# EAGLE design pcb_Becker (EAGLE 8.0.0)
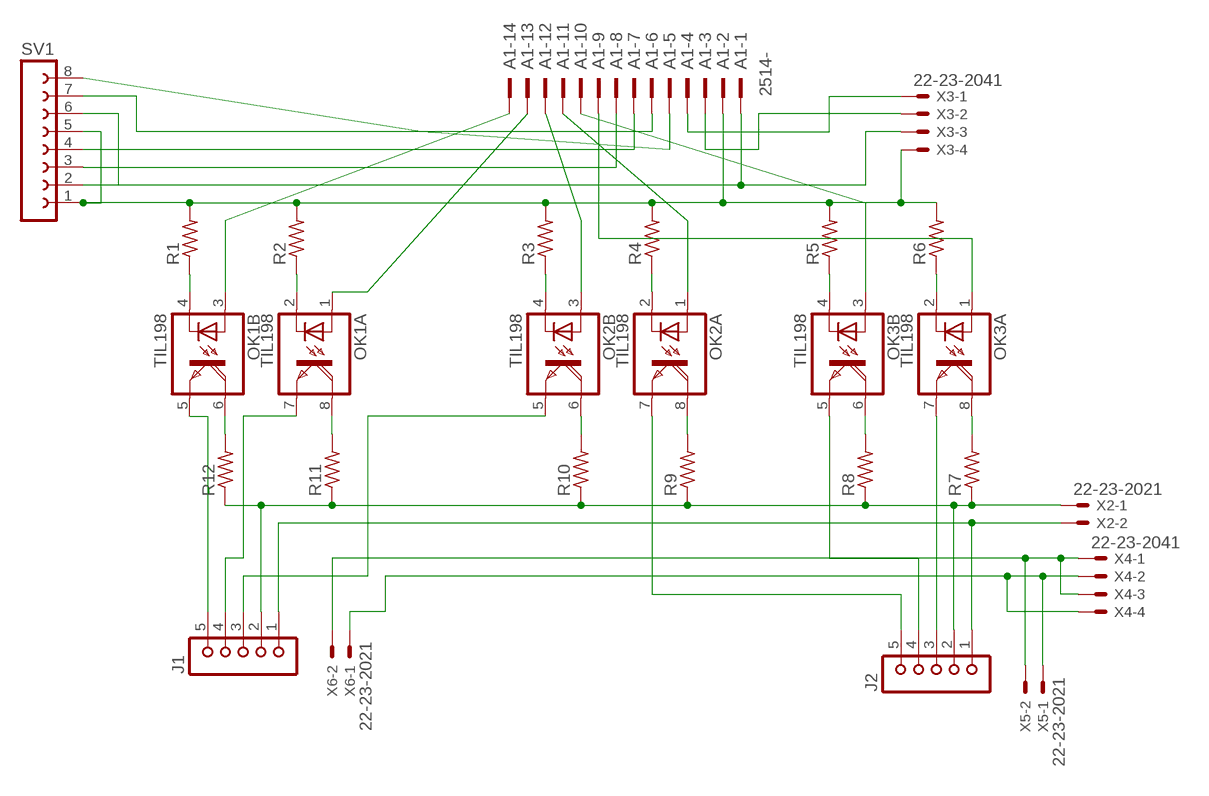
[diagram p0: schematic, sheet 1]

## Parts
A1  2514-  [PAK100/2500-14]
J1  JU05  [JU05]
J2  JU05  [JU05]
OK1  TIL198  [DIL08]
OK2  TIL198  [DIL08]
OK3  TIL198  [DIL08]
R1  R-US_0207/10  [0207/10]
R2  R-US_0207/10  [0207/10]
R3  R-US_0207/10  [0207/10]
R4  R-US_0207/10  [0207/10]
R5  R-US_0207/10  [0207/10]
R6  R-US_0207/10  [0207/10]
R7  R-US_0207/10  [0207/10]
R8  R-US_0207/10  [0207/10]
R9  R-US_0207/10  [0207/10]
R10  R-US_0207/10  [0207/10]
R11  R-US_0207/10  [0207/10]
R12  R-US_0207/10  [0207/10]
SV1  FE08-1  [FE08]
X2  22-23-2021  [22-23-2021]
X3  22-23-2041  [22-23-2041]
X4  22-23-2041  [22-23-2041]
X5  22-23-2021  [22-23-2021]
X6  22-23-2021  [22-23-2021]

## Nets
N$1: OK1.4(B:C) R1.1
N$2: OK1.2(A:C) R2.1
N$3: OK2.4(B:C) R3.1
N$4: OK2.2(A:C) R4.1
N$5: OK3.4(B:C) R5.1
N$6: OK3.2(A:C) R6.1
N$7: OK3.8(A:COL) R7.2
N$8: OK3.6(B:COL) R8.2
N$9: OK2.8(A:COL) R9.2
N$10: OK2.6(B:COL) R10.2
N$11: OK1.8(A:COL) R11.2
N$12: OK1.6(B:COL) R12.2
N$13: A1.14 OK1.3(B:A)
N$14: A1.13 OK1.1(A:A)
N$15: A1.12 OK2.3(B:A)
N$16: A1.11 OK2.1(A:A)
N$17: A1.10 OK3.3(B:A)
N$18: A1.9 OK3.1(A:A)
N$19: A1.2 R1.2 R2.2 R3.2 R4.2 R5.2 R6.2 SV1.1 SV1.5 X3.4
N$20: J1.5 OK1.5(B:EMI)
N$21: J1.4 OK1.7(A:EMI)
N$22: J1.3 OK2.5(B:EMI)
N$23: J2.5 OK2.7(A:EMI)
N$24: J2.4 OK3.5(B:EMI)
N$25: J2.3 OK3.7(A:EMI)
N$26: J1.2 J2.2 R7.1 R8.1 R9.1 R10.1 R11.1 R12.1 X2.1
N$27: J1.1 J2.1 X2.2
N$28: A1.1 SV1.2 SV1.6 X3.3
N$29: A1.8 SV1.3
N$30: A1.7 SV1.4
N$31: A1.6 SV1.7
N$32: A1.5 SV1.8
N$33: A1.4 X3.1
N$34: A1.3 X3.2
N$35: X4.1 X4.3 X5.2 X6.2
N$36: X4.2 X4.4 X5.1 X6.1

## Library data of the parts
A1 = con-3m:2514-: 3M (TM) Pak 100 4-Wall Header Source: 3M; OC_FARNELL: unknown; OC_NEWARK: unknown
J1 J2 = con-lsta:JU05: PIN HEADER; OC_FARNELL: unknown; OC_NEWARK: unknown
OK1-OK3 = optocoupler-2:TIL198: TEXAS INSTRUMENTS OPTO COUPLER
R1-R12 = resistor:R-US_: RESISTOR, American symbol
SV1 = con-lsta:FE08-1: FEMALE HEADER; OC_FARNELL: unknown; OC_NEWARK: unknown
X2 X5 X6 = con-molex:22-23-2021: .100" (2.54mm) Center Header - 2 Pin; MF: MOLEX; MPN: 22-23-2021; OC_FARNELL: 1462926; OC_NEWARK: 25C3832
X3 X4 = con-molex:22-23-2041: .100" (2.54mm) Center Header - 4 Pin; MF: MOLEX; MPN: 22-23-2041; OC_FARNELL: 1462920; OC_NEWARK: 38C0355

## Board
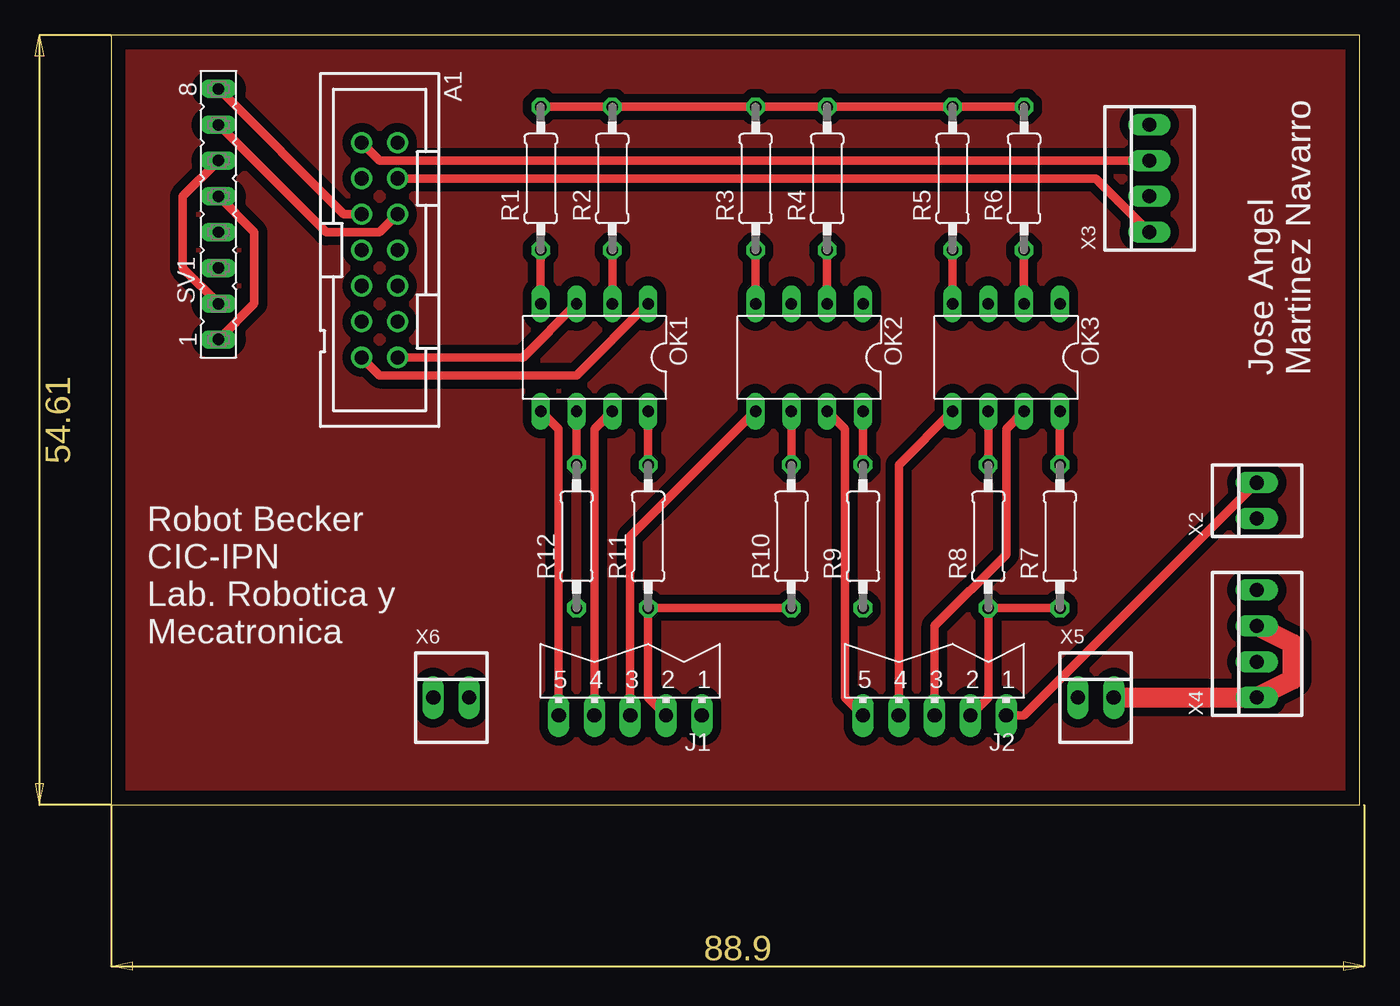
[diagram p1: board, top side]
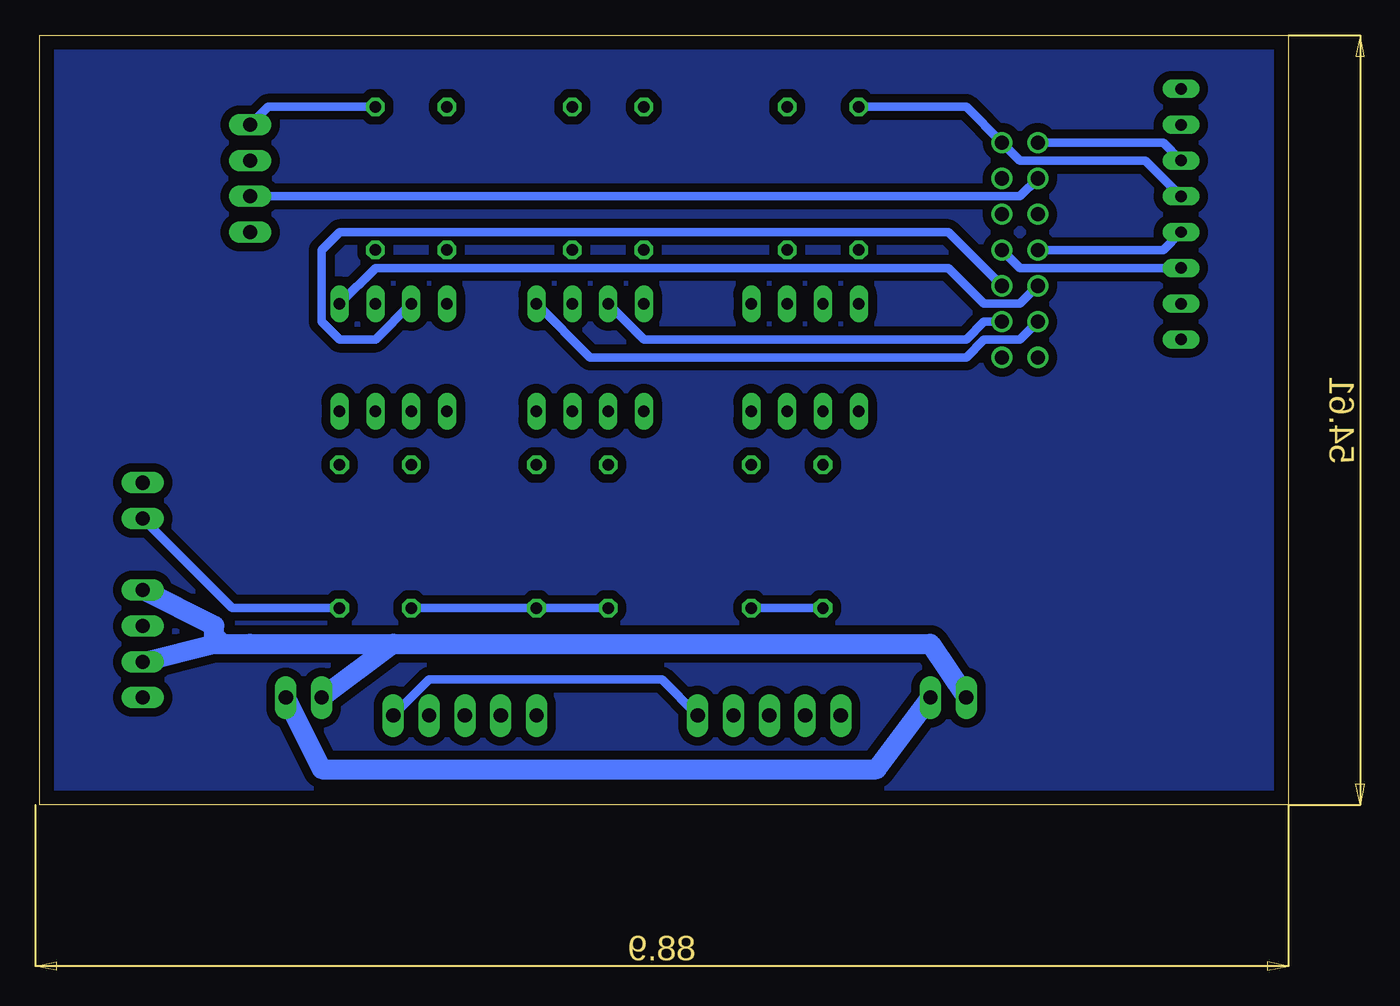
[diagram p2: board, bottom side, seen from below]

Size 88.57 x 54.6 mm. Coordinates in mm from the lower left corner, seen from the top.
Outline: 0,0 88.57,0 88.57,54.6 0,54.6 0,0
Copper layers (1*16): Top 0.035mm / dielectric 1.5mm / Bottom 0.035mm
Design rules "default": minimum track width 10mil, minimum drill 24mil, track to track 8mil, track to pad 8mil, pad to pad 8mil, via to via 8mil, smd to smd 8mil, copper to edge 40mil, drill to drill 8mil, minimum pad ring 10mil, minimum via ring 8mil, stop-mask expansion 4mil, vias tented up to drill 0mil, thermal gap 10mil

### Footprints (pad centres in the part's own frame; a part is rotated, then mirrored left to right if it is on the bottom)
PAK100/2500-14 = drill 1 pad 1.422: 1 -7.62,-1.27; 2 -7.62,1.27; 3 -5.08,-1.27; 4 -5.08,1.27; 5 -2.54,-1.27; 6 -2.54,1.27; 7 0,-1.27; 8 0,1.27; 9 2.54,-1.27; 10 2.54,1.27; 11 5.08,-1.27; 12 5.08,1.27; 13 7.62,-1.27; 14 7.62,1.27
JU05 = drill 1.016 long: 1 -5.08,0; 2 -2.54,0; 3 0,0; 4 2.54,0; 5 5.08,0
DIL08 = drill 0.813 long: 1 -3.81,-3.81; 2 -1.27,-3.81; 3 1.27,-3.81; 4 3.81,-3.81; 5 3.81,3.81; 6 1.27,3.81; 7 -1.27,3.81; 8 -3.81,3.81
0207/10 = drill 0.813 octagon: 1 -5.08,0; 2 5.08,0
FE08 = drill 0.813 long: 1 -8.89,0; 2 -6.35,0; 3 -3.81,0; 4 -1.27,0; 5 1.27,0; 6 3.81,0; 7 6.35,0; 8 8.89,0
22-23-2021 = drill 1 long: 1 -1.27,0; 2 1.27,0
22-23-2041 = drill 1 long: 1 -3.81,0; 2 -1.27,0; 3 1.27,0; 4 3.81,0

### Placement (x,y rotation side)
A1  19.05,39.37 270 top
J1  36.83,6.35 180 top
J2  58.42,6.35 180 top
OK1  34.29,31.75 180 top
OK2  49.53,31.75 180 top
OK3  63.5,31.75 180 top
R1  30.48,44.45 90 top
R2  35.56,44.45 90 top
R3  45.72,44.45 90 top
R4  50.8,44.45 90 top
R5  59.69,44.45 90 top
R6  64.77,44.45 90 top
R7  67.31,19.05 90 top
R8  62.23,19.05 90 top
R9  53.34,19.05 90 top
R10  48.26,19.05 90 top
R11  38.1,19.05 90 top
R12  33.02,19.05 90 top
SV1  7.62,41.91 90 top
X2  81.28,21.59 90 top
X3  73.66,44.45 90 top
X4  81.28,11.43 90 top
X5  69.85,7.62 0 top
X6  24.13,7.62 0 top

### Tracks (layer width: path | path; a pad name or v marks a point on that pad's centre or on a via)
N$1
  Top 0.61: R1.1 OK1.4
N$2
  Top 0.61: R2.1 OK1.2
N$3
  Top 0.61: R3.1 OK2.4
N$4
  Top 0.61: R4.1 OK2.2
N$5
  Top 0.61: R5.1 OK3.4
N$6
  Top 0.61: R6.1 OK3.2
N$7
  Top 0.61: OK3.8 R7.2
N$8
  Top 0.61: OK3.6 R8.2
N$9
  Top 0.61: OK2.8 R9.2
N$10
  Top 0.61: OK2.6 R10.2
N$11
  Top 0.61: OK1.8 R11.2
N$12
  Top 0.61: OK1.6 R12.2
N$13
  Top 0.61: OK1.3 29.21,31.75 A1.14
N$14
  Top 0.61: OK1.1 33.02,30.48 19.05,30.48 A1.13
N$15
  Bottom 0.61: OK2.3 45.72,33.02 22.86,33.02 21.59,34.29 A1.12
N$16
  Bottom 0.61: OK2.1 49.53,31.75 22.86,31.75 21.59,33.02 19.05,33.02 A1.11
N$17
  Bottom 0.61: OK3.3 64.77,33.02 67.31,33.02 68.58,34.29 68.58,39.37 67.31,40.64 24.13,40.64 A1.10
N$18
  Bottom 0.61: OK3.1 64.77,38.1 24.13,38.1 21.59,35.56 19.05,35.56 A1.9
N$19
  Top 0.61: R6.2 R5.2 R4.2 R3.2 R2.2 R1.2 | SV1.1 10.16,35.56 10.16,40.64 SV1.5
  Bottom 0.61: X3.4 72.39,49.53 R6.2 | R1.2 22.86,49.53 A1.2 19.05,45.72 10.16,45.72 SV1.5
N$20
  Top 0.61: OK1.5 31.75,26.67 J1.5
N$21
  Top 0.61: OK1.7 34.29,26.67 J1.4
N$22
  Top 0.61: OK2.5 36.83,19.05 J1.3
N$23
  Top 0.61: OK2.7 52.07,26.67 52.07,7.62 J2.5
N$24
  Top 0.61: OK3.5 55.88,24.13 J2.4
N$25
  Top 0.61: OK3.7 63.5,26.67 63.5,17.78 58.42,12.7 J2.3
N$26
  Top 0.61: J1.2 38.1,7.62 R11.1 R10.1 | R7.1 R8.1 62.23,7.62 J2.2
  Bottom 0.61: R11.1 R12.1 | R10.1 R9.1 R8.1 | X2.1 74.93,13.97 R7.1
N$27
  Top 0.61: X2.2 64.77,6.35 J2.1
  Bottom 0.61: J1.1 44.45,8.89 60.96,8.89 J2.1
N$28
  Top 0.61: SV1.2 5.08,38.1 5.08,43.18 SV1.6 | X3.3 19.05,45.72 A1.1
  Bottom 0.61: A1.1 8.89,46.99 SV1.6
N$29
  Bottom 0.61: SV1.3 19.05,38.1 A1.8
N$30
  Bottom 0.61: SV1.4 8.89,39.37 A1.7
N$31
  Top 0.61: SV1.7 15.24,40.64 19.05,40.64 A1.6
N$32
  Top 0.61: SV1.8 16.51,41.91 A1.5
N$33
  Top 0.61: A1.4 69.85,44.45 X3.1
N$34
  Bottom 0.61: A1.3 19.05,43.18 X3.2
N$35
  Top 1.422: X5.2 X4.1 83.82,8.89 83.82,11.43 X4.3
  Bottom 1.422: X6.2 29.21,2.54 68.58,2.54 X5.2
N$36
  Bottom 0.406: 76.2,12.7 74.93,11.43 73.66,11.43
  Bottom 1.422: X6.1 25.4,11.43 63.5,11.43 | X4.2 76.2,11.43 | 76.2,11.43 73.66,11.43 63.5,11.43 | 63.5,11.43 X5.1 | 76.2,11.43 76.2,12.7 X4.4
N$37
  pour Top (isolate 0.61): 0,54.61 88.9,54.61 88.9,0 0,0
N$38
  pour Bottom (isolate 0.61): 0,54.61 88.9,54.61 88.9,0 0,0

### Text on the board
tNames: Jose Angel / Martinez Navarro | Robot Becker / CIC-IPN / Lab. Robotica y / Mecatronica